# Altium schematic sheet payload.SchDoc
size A4
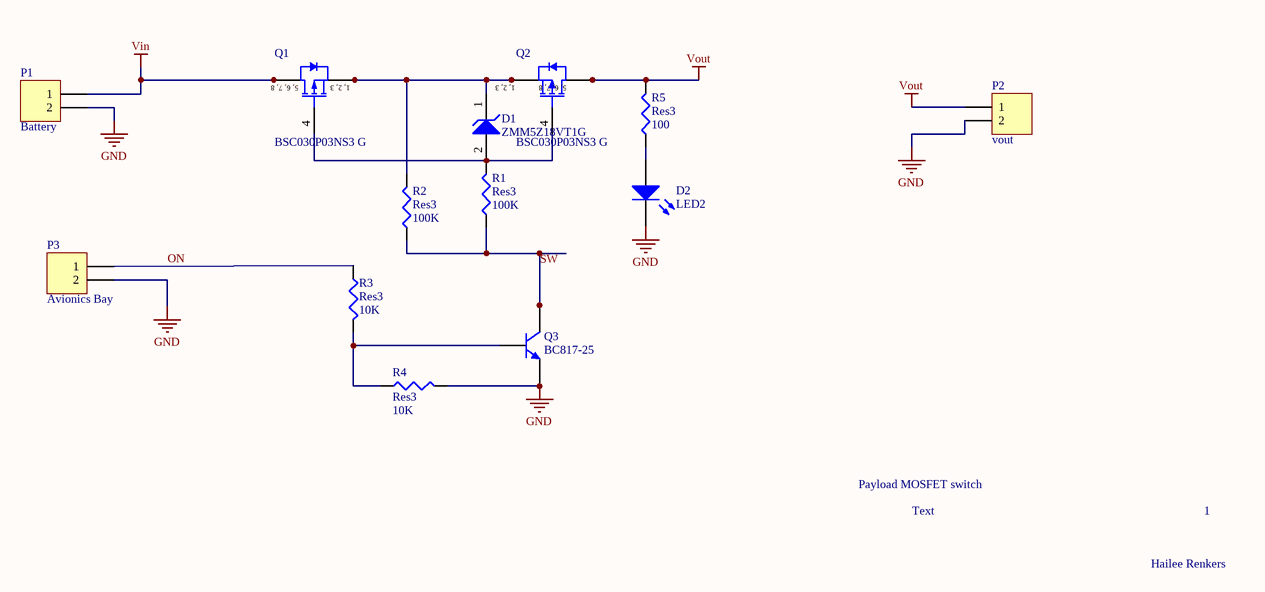
[diagram p0: payload.SchDoc]

## Parts
D1  ZMM5Z18VT1G  [ONSC-SOD-523-2-502-01_V]
D2  LED2  [3.2X1.6X1.1]
P1  Battery  [HDR1X2]
P2  vout  [HDR1X2]
P3  Avionics Bay  [HDR1X2]
Q1  BSC030P03NS3 G  [INF-PG-TDSON-8-1_V]
Q2  BSC030P03NS3 G  [INF-PG-TDSON-8-1_V]
Q3  BC817-25  [SOT-23A_N]
R1  Res3  value 100K  [J1-0603]
R2  Res3  value 100K  [J1-0603]
R3  Res3  value 10K  [J1-0603]
R4  Res3  value 10K  [J1-0603]
R5  Res3  value 100  [J1-0603]

## Nets
GND: D2.2(K) P1.2 P2.2 P3.2 Q3.2(E) R4.2
Vin: P1.1 Q1.5(DRAIN) Q1.6(DRAIN) Q1.7(DRAIN) Q1.8(DRAIN)
Vout: P2.1 Q2.5(DRAIN) Q2.6(DRAIN) Q2.7(DRAIN) Q2.8(DRAIN) R5.2
ON: P3.1 R3.1
SW: Q3.3(C) R1.1 R2.1
NetD1_1: D1.1(K) Q1.1(SOURCE) Q1.2(SOURCE) Q1.3(SOURCE) Q2.1(SOURCE) Q2.2(SOURCE) Q2.3(SOURCE) R2.2
NetD1_2: D1.2(A) Q1.4(GATE) Q2.4(GATE) R1.2
NetD2_1: D2.1(A) R5.1
NetQ3_1: Q3.1(B) R3.2 R4.1

## Notes on the sheet
- Payload MOSFET switch
- Text
- 1
- Hailee Renkers
- (in symbol BSC030P03NS3 G) 5, 6, 7, 8; 1, 2, 3

## Library data of the parts
D1 = ZMM5Z18VT1G: Zener Voltage Regulator, 500 mW, 2-Pin SOD-523, Pb-Free, Tape and Reel; Manufacturer: On Semiconductor; P Max (W): 0.5; VZ Typ (V): 18; DatasheetVersion: Rev. 10; PackageVersion: Rev. E, 09/2010; PackageReference: SOD-523-2-502-01; PackageDescription: 2-Pin SOD, Body 1.2 x 0.8 mm; Packing: Tape and Reel; RoHS: Pb-Free; Mounting Technology: Surface Mount; PartNumber: ZMM5Z18VT1G; ComponentLink1Description: Manufacturer URL; ComponentLink1URL: http://www.onsemi.com/; ComponentLink2Description: Datasheet; ComponentLink2URL: http://www.onsemi.cn/pub_link/Collateral/MM5Z2V4T1-D.PDF; ComponentLink3Description: Package Specification; ComponentLink3URL: http://www.onsemi.com/pub_link/Collateral/502-01.PDF
D2 = LED2: Typical RED, GREEN, YELLOW, AMBER GaAs LED; Published: 8-Jun-2000; LatestRevisionDate: 17-Jul-2002; LatestRevisionNote: Re-released for DXP Platform.; PackageVersion: Feb-2002; PackageReference: 3.2X1.6X1.1; Publisher: Altium Limited; PackageDescription: SM LED; 2 Flat Leads
P1-P3 = Header 2: Header, 2-Pin; LatestRevisionDate: 17-Jul-2002; LatestRevisionNote: Re-released for DXP Platform.; Publisher: Altium Limited
Q1 Q2 = BSC030P03NS3 G: P-Channel OptiMOS P3 Power-Transistor, -30 V VDS, -100 A ID, -55 to 150 degC, PG-TDSON-8-1, Reel, Green; Manufacturer: Infineon; Green: TRUE; ID (max): -100 A; IDpuls (max): -200 A; Pto t (max): 125 W; QG: 137 nC; RDS (on) (max): 3 mOhm; Rth: 1 K/W; VDS (max): -30 V; VGS(th) (max): -1.9 V; VGS(th) (min): -3.1 V; DatasheetVersion: Rev. 2.1; PackageReference: PG-TDSON-8-1; PackageDescription: 8-Pin Plastic (Green) Thin Dual Small Outline Non-Leaded Package, 5.15 x 5.9 mm Body, 1.27 mm Pitch; Supplier 1: Mouser; Supplier Part Number 1: 726-BSC030P03NS3G; Supplier 2: Digi-Key; Supplier Part Number 2: BSC030P03NS3 GTR-ND; Supplier 3: Digi-Key; Supplier Part Number 3: BSC030P03NS3 GCT-ND; Supplier 4: Digi-Key; Supplier Part Number 4: BSC030P03NS3 GDKR-ND; Halogen-free: TRUE; Packing: Reel; RthJC (max): 1 K/W; Mounting Technology: Surface Mount; PartNumber: BSC030P03NS3 G; ComponentLink1Description: Manufacturer URL; ComponentLink1URL: http://www.infineon.com/; ComponentLink2Description: Datasheet; ComponentLink2URL: http://www.infineon.com/dgdl/BSC030P03NS3+G_2.1.pdf?folderId=db3a304314dca38901154a72e3951a65&fileId=db3a30431d8a6b3c011d90d084910435; ComponentLink3Description: Package Specification; ComponentLink3URL: http://www.infineon.com/cms/packages/SMD_-_Surface_Mounted_Devices/P-PG-TDSON/P-PG-TDSON-08-01x_2x_3.html?__locale=en
Q3 = BC817-25: NPN General Purpose Amplifier; Published: 8-Jun-2000; LatestRevisionDate: 20-Nov-2009; LatestRevisionNote: IPC-7351 Footprint Added.; DatasheetVersion: 1997; PackageVersion: Sep-1998; PackageReference: SOT-23A; Publisher: Altium Limited; PackageDescription: 3-Pin SOT-23 Package 0.95 mm Pitch, 2.3 mm Lead Span; ComponentLink1Description: Manufacturer Link; ComponentLink1URL: http://www.fairchildsemi.com/; ComponentLink2Description: Discontinuation Notice; ComponentLink2URL: http://www.fairchildsemi.com/obsolete/obs.jsp
R1-R5 = Res3: Resistor; Published: 8-Jun-2000; LatestRevisionDate: 29-May-2009; LatestRevisionNote: IPC-7351 Footprint Added.; PackageReference: J1-0603; Publisher: Altium Limited; PackageDescription: Chip Resistor